# EAGLE design ANISMADriverBoard_v02 (EAGLE 9.5.2)
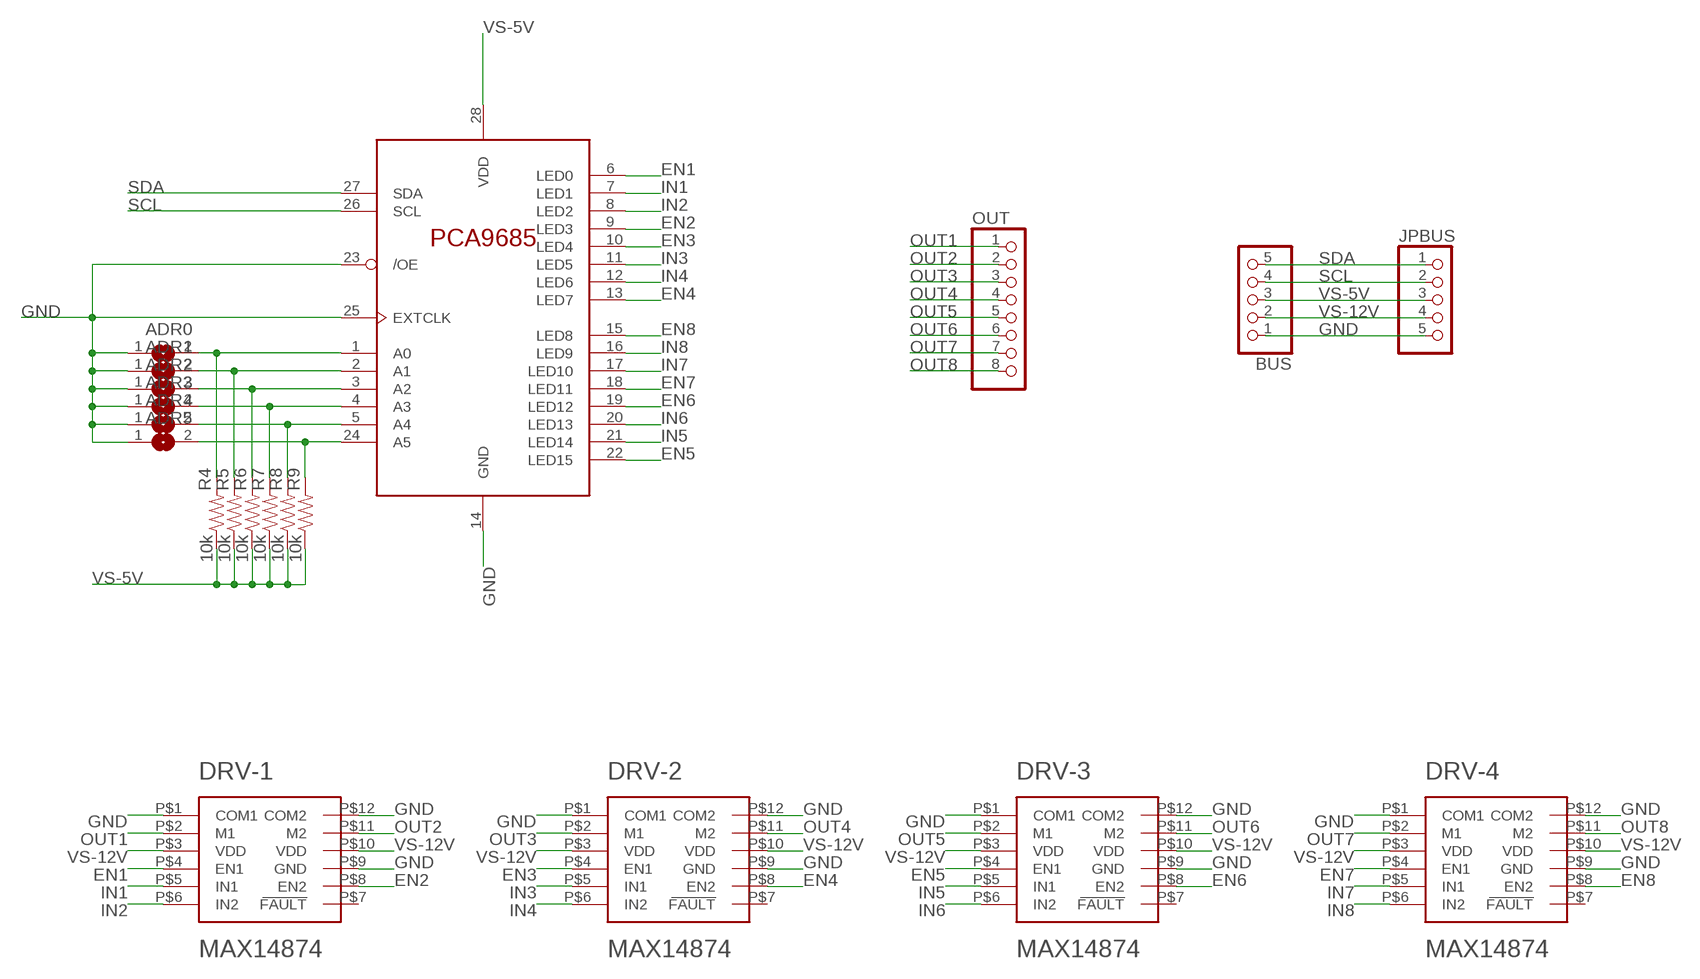
[diagram p0: schematic, sheet 1]

## Parts
ADR0  SJ  [SJ]
ADR1  SJ  [SJ]
ADR2  SJ  [SJ]
ADR3  SJ  [SJ]
ADR4  SJ  [SJ]
ADR5  SJ  [SJ]
BUS  PINHD-1X5/90  [1X05/90]
DRV-1  MAX14874  [TD1233]
DRV-2  MAX14874  [TD1233]
DRV-3  MAX14874  [TD1233]
DRV-4  MAX14874  [TD1233]
JPBUS  PINHD-1X5/90  [1X05/90]
OUT  PINHD-1X8/90  [1X08/90]
PCA9685  PCA9685PW  [TSSOP28]
R4  10k  10KOHM-0603-1/10W-1%  [0603]
R5  10k  10KOHM-0603-1/10W-1%  [0603]
R6  10k  10KOHM-0603-1/10W-1%  [0603]
R7  10k  10KOHM-0603-1/10W-1%  [0603]
R8  10k  10KOHM-0603-1/10W-1%  [0603]
R9  10k  10KOHM-0603-1/10W-1%  [0603]

## Nets
EN1: DRV-1.P$4(EN1) PCA9685.6(LED0)
EN2: DRV-1.P$8(EN2) PCA9685.9(LED3)
EN3: DRV-2.P$4(EN1) PCA9685.10(LED4)
EN4: DRV-2.P$8(EN2) PCA9685.13(LED7)
EN5: DRV-3.P$4(EN1) PCA9685.22(LED15)
EN6: DRV-3.P$8(EN2) PCA9685.19(LED12)
EN7: DRV-4.P$4(EN1) PCA9685.18(LED11)
EN8: DRV-4.P$8(EN2) PCA9685.15(LED8)
GND: ADR0.1 ADR1.1 ADR2.1 ADR3.1 ADR4.1 ADR5.1 BUS.1 DRV-1.P$1(COM1) DRV-1.P$9(GND) DRV-1.P$12(COM2) DRV-2.P$1(COM1) DRV-2.P$9(GND) DRV-2.P$12(COM2) DRV-3.P$1(COM1) DRV-3.P$9(GND) DRV-3.P$12(COM2) DRV-4.P$1(COM1) DRV-4.P$9(GND) DRV-4.P$12(COM2) JPBUS.5 PCA9685.14(GND) PCA9685.23(/OE) PCA9685.25(EXTCLK)
IN1: DRV-1.P$5(IN1) PCA9685.7(LED1)
IN2: DRV-1.P$6(IN2) PCA9685.8(LED2)
IN3: DRV-2.P$5(IN1) PCA9685.11(LED5)
IN4: DRV-2.P$6(IN2) PCA9685.12(LED6)
IN5: DRV-3.P$5(IN1) PCA9685.21(LED14)
IN6: DRV-3.P$6(IN2) PCA9685.20(LED13)
IN7: DRV-4.P$5(IN1) PCA9685.17(LED10)
IN8: DRV-4.P$6(IN2) PCA9685.16(LED9)
N$3: ADR0.2 PCA9685.1(A0) R4.2
N$4: ADR1.2 PCA9685.2(A1) R5.2
N$5: ADR2.2 PCA9685.3(A2) R6.2
N$6: ADR3.2 PCA9685.4(A3) R7.2
N$7: ADR4.2 PCA9685.5(A4) R8.2
N$8: ADR5.2 PCA9685.24(A5) R9.2
OUT1: DRV-1.P$2(M1) OUT.1
OUT2: DRV-1.P$11(M2) OUT.2
OUT3: DRV-2.P$2(M1) OUT.3
OUT4: DRV-2.P$11(M2) OUT.4
OUT5: DRV-3.P$2(M1) OUT.5
OUT6: DRV-3.P$11(M2) OUT.6
OUT7: DRV-4.P$2(M1) OUT.7
OUT8: DRV-4.P$11(M2) OUT.8
SCL: BUS.4 JPBUS.2 PCA9685.26(SCL)
SDA: BUS.5 JPBUS.1 PCA9685.27(SDA)
VS-5V: BUS.3 JPBUS.3 PCA9685.28(VDD) R4.1 R5.1 R6.1 R7.1 R8.1 R9.1
VS-12V: BUS.2 DRV-1.P$3(VDD) DRV-1.P$10(VDD) DRV-2.P$3(VDD) DRV-2.P$10(VDD) DRV-3.P$3(VDD) DRV-3.P$10(VDD) DRV-4.P$3(VDD) DRV-4.P$10(VDD) JPBUS.4
Unconnected: DRV-1.P$7(FAULT) DRV-2.P$7(FAULT) DRV-3.P$7(FAULT) DRV-4.P$7(FAULT)

## Library data of the parts
ADR0 ADR1-ADR5 = jumper:SJ: SMD solder JUMPER
BUS JPBUS = pinhead:PINHD-1X5: PIN HEADER
DRV-1-DRV-4 = Mo Custom Components:MAX14874
OUT = pinhead:PINHD-1X8: PIN HEADER
PCA9685 = i2c-led-controller:PCA9685
R4-R9 = SparkFun-Resistors:10KOHM: 10kΩ resistor A resistor is a passive two-terminal electrical component that implements electrical resistance as a circuit element. Resistors act to reduce current flow, and, at the same time, act to lower voltage levels within circuits. - Wikipedia; PROD_ID: RES-00824; SPICEPREFIX: R

## Board
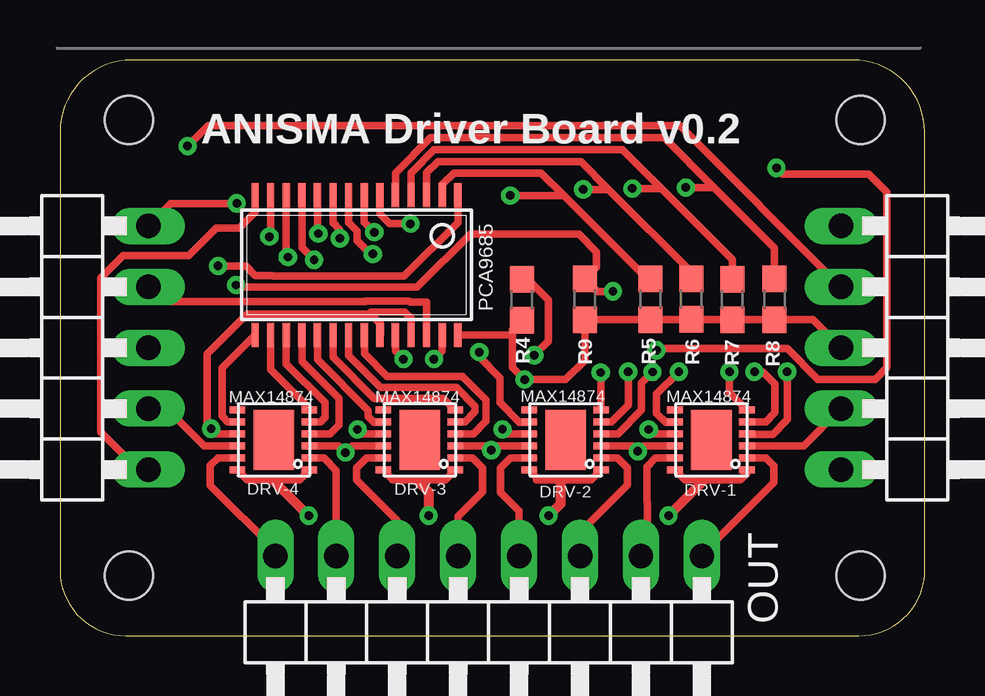
[diagram p1: board, top side]
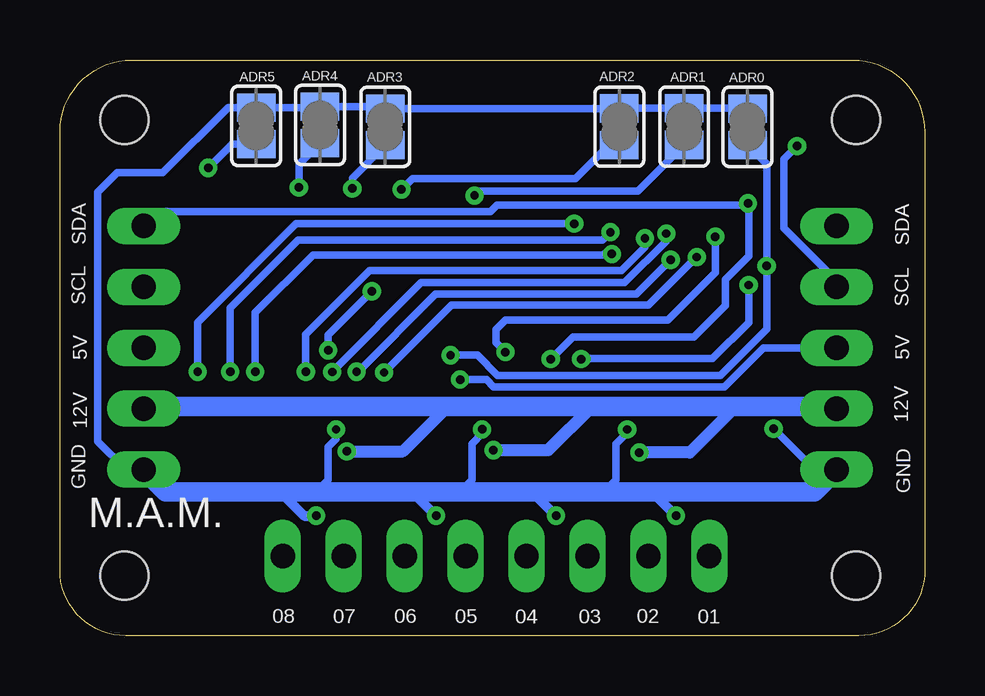
[diagram p2: board, bottom side, seen from below]

Size 36.05 x 24.01 mm. Coordinates in mm from the lower left corner, seen from the top.
Outline: 36.05,2.51 36.05,21.01 arc90 33.05,24.01 3,24.01 arc90 0,21.01 0,2.51 arc90 3,0.01 33.05,0.01 arc90 36.05,2.51
Copper layers (1*16): Top 0.035mm / dielectric 1.5mm / Bottom 0.035mm
Design rules "default *": minimum track width 6mil, minimum drill 0.35mm, track to track 6mil, track to pad 6mil, pad to pad 6mil, via to via 6mil, smd to smd 6mil, copper to edge 40mil, drill to drill 6mil, minimum pad ring 10mil, minimum via ring 8mil, stop-mask expansion 4mil, vias tented up to drill 0.5mm, thermal gap 10mil
Holes 2 mm at 2.87,21.51 2.87,2.51 33.37,2.51 33.37,21.51

### Footprints (pad centres in the part's own frame; a part is rotated, then mirrored left to right if it is on the bottom)
SJ = smd 1.168 x 1.6: 1 -0.762,0; 2 0.762,0
1X05/90 = drill 1.016 long: 1 -5.08,-3.81; 2 -2.54,-3.81; 3 0,-3.81; 4 2.54,-3.81; 5 5.08,-3.81
TD1233 = smd 0.65 x 0.3: P$1 -1.475,1.25; P$2 -1.475,0.75; P$3 -1.475,0.25; P$4 -1.475,-0.25; P$5 -1.475,-0.75; P$6 -1.475,-1.25; P$7 1.525,-1.25; P$8 1.525,-0.75; P$9 1.525,-0.25; P$10 1.525,0.25; P$11 1.525,0.75; P$12 1.525,1.25 | smd 1.7 x 2.5: P$13 0,0
1X08/90 = drill 1.016 long: 1 -8.89,-3.81; 2 -6.35,-3.81; 3 -3.81,-3.81; 4 -1.27,-3.81; 5 1.27,-3.81; 6 3.81,-3.81; 7 6.35,-3.81; 8 8.89,-3.81
TSSOP28 = smd 0.305 x 0.991: 1 -4.225,-2.918; 2 -3.575,-2.918; 3 -2.925,-2.918; 4 -2.275,-2.918; 5 -1.625,-2.918; 6 -0.975,-2.918; 7 -0.325,-2.918; 8 0.325,-2.918; 9 0.975,-2.918; 10 1.625,-2.918; 11 2.275,-2.918; 12 2.925,-2.918; 13 3.575,-2.918; 14 4.225,-2.918; 15 4.225,2.918; 16 3.575,2.918; 17 2.925,2.918; 18 2.275,2.918; 19 1.625,2.918; 20 0.975,2.918; 21 0.325,2.918; 22 -0.325,2.918; 23 -0.975,2.918; 24 -1.625,2.918; 25 -2.275,2.918; 26 -2.925,2.918; 27 -3.575,2.918; 28 -4.225,2.918
0603 = smd 1.1 x 1: 1 -0.85,0; 2 0.85,0

### Placement (x,y rotation side)
ADR0  7.39,21.22 270 bottom
ADR1  10.03,21.23 270 bottom
ADR2  12.73,21.23 270 bottom
ADR3  22.49,21.22 270 bottom
ADR4  25.21,21.3 270 bottom
ADR5  27.87,21.26 270 bottom
BUS  -0.13,12.01 90 top
DRV-1  27.16,8.17 180 top
DRV-2  21.08,8.17 180 top
DRV-3  15,8.17 180 top
DRV-4  8.92,8.17 180 top
JPBUS  36.37,12.01 270 top
OUT  17.87,-0.49 180 top
PCA9685  12.36,15.46 180 top
R4  19.25,14.01 90 top
R5  24.62,14.03 90 top
R6  26.32,14.04 90 top
R7  28.03,14.02 90 top
R8  29.79,14.03 90 top
R9  21.88,14.03 90 top

### Tracks (layer width: path | path; a pad name or v marks a point on that pad's centre or on a via)
EN1  (via drill 0.35)
  Top 0.305: DRV-1.P$4 28.65,8.41 29.71,8.41 30.32,9.02 30.32,10.65 30.31,10.66 v30.31,11.01 | PCA9685.6 13.34,17.59 13.74,17.18 v14.61,17.18
  Bottom 0.305: v14.61,17.18 26.2,17.18 30.31,13.07 v30.31,11.01
EN2  (via drill 0.35)
  Top 0.305: DRV-1.P$8 25.6,8.89 25.26,8.89 24.87,9.28 24.87,10.08 v25.8,11.01 | PCA9685.9 11.39,17.2 11.4,17.21 11.66,16.94 v11.66,16.57
  Bottom 0.305: v11.66,16.57 11.66,16.22 12.65,15.23 23.15,15.23 25.81,12.57 25.81,10.96 25.8,10.97 v25.8,11.01
EN3  (via drill 0.35)
  Top 0.305: DRV-2.P$4 23.25,8.42 24.24,9.41 24.24,10.54 v24.7,11 | PCA9685.10 10.73,16.81 v10.77,16.77
  Bottom 0.305: v10.77,16.77 10.77,16.46 12.51,14.72 21,14.72 24.61,11.11 24.61,11.09 v24.7,11
EN4  (via drill 0.35)
  Top 0.305: DRV-2.P$8 19.54,8.91 19.16,8.91 18.35,9.72 18.35,10.76 17.48,11.63 v17.48,11.83 | PCA9685.13 8.79,16.69 v8.73,16.64
  Bottom 0.305: v8.73,16.64 8.73,15.15 10.71,13.17 17.48,13.17 17.87,12.78 17.87,12.22 v17.48,11.83
EN5
  Top 0.305: DRV-3.P$4 17.24,8.42 17.77,8.95 17.77,9.83 16.79,10.82 13.65,10.82 12.69,11.77 PCA9685.22
EN6
  Top 0.305: DRV-3.P$8 13.46,8.91 13.08,8.91 12.84,9.15 12.84,9.41 10.73,11.52 PCA9685.19
EN7
  Top 0.305: DRV-4.P$4 11.25,8.42 11.63,8.8 11.63,9.89 10.09,11.44 PCA9685.18
EN8
  Top 0.305: DRV-4.P$8 6.98,8.93 6.75,9.16 6.75,11.16 PCA9685.15
GND  (via drill 0.35)
  Top 0.305: DRV-4.P$1 9.98,6.51 8.87,6.51 7.81,6.51 DRV-4.P$12 | DRV-3.P$12 13.87,6.53 13.87,6.51 14.87,6.51 16.07,6.51 DRV-3.P$1 | DRV-2.P$12 19.87,6.61 19.87,6.51 20.87,6.51 22.14,6.51 DRV-2.P$1 | DRV-1.P$12 26.05,6.51 26.87,6.51 28.37,6.51 28.64,6.78 DRV-1.P$1 | DRV-3.P$9 12.4,8.42 v12.4,8.6 | DRV-4.P$9 6.41,8.42 6.3,8.53 v6.3,8.63 6.13,8.8 6.13,11.75 7.8,13.42 12.87,13.42 | DRV-2.P$9 19.55,8.41 18.67,8.41 18.47,8.61 v18.45,8.61 | DRV-1.P$9 24.72,8.42 v24.54,8.6 | BUS.1 3.27,6.93 1.7,8.5 1.7,14.92 2.64,15.86 5.37,15.86 6.52,17.01 7.48,17.01 8.14,17.67 PCA9685.14 | 12.87,13.42 12.96,13.42 13.37,13.01 13.37,12.58 PCA9685.23 | PCA9685.25 14.64,13.25 14.37,13.51 12.96,13.51 12.87,13.42
  Top 0.406: 8.87,6.51 v10.37,5.01 | 14.87,6.51 15.37,6.01 v15.37,5.01 | 20.87,6.51 20.87,5.51 v20.37,5.01 | v25.37,5.01 26.87,6.51
  Bottom 0.305: 16.37,6.01 16.87,6.01 | 21.37,6.01 21.87,6.01 | v12.4,8.6 12.4,8.48 12.87,8.01 12.87,6.51 13.37,6.01 | v6.3,8.63 4.6,6.93 BUS.1 | v18.45,8.61 18.45,8.43 18.87,8.01 18.87,6.51 19.37,6.01 | v24.54,8.6 24.54,8.21 24.87,7.88 24.87,6.51 25.37,6.01 | JPBUS.5 33.29,6.93 34.47,8.11 34.47,18.5 33.66,19.31 31.76,19.31 29.05,22.02 ADR5.1 25.25,22.02 ADR4.1 22.57,22.06 ADR3.1 ADR2.1 ADR1.1 7.4,21.99 ADR0.1
  Bottom 0.406: v10.37,5.01 11.37,6.01 | v15.37,5.01 16.37,6.01 | v20.37,5.01 21.37,6.01 | 26.87,6.01 25.87,5.01 v25.37,5.01
  Bottom 0.813: BUS.1 4.6,6.01 11.37,6.01 13.37,6.01 16.87,6.01 19.37,6.01 21.87,6.01 25.37,6.01 26.87,6.01 31.64,6.01 JPBUS.5
IN1  (via drill 0.35)
  Top 0.305: DRV-1.P$5 29.42,8.92 29.81,9.31 29.81,10.51 29.31,11.01 v28.95,11.01 | PCA9685.7 12.68,17.25 v13.1,16.83
  Bottom 0.305: v13.1,16.83 13.44,16.49 26.13,16.49 28.95,13.67 v28.95,11.01
IN2  (via drill 0.35)
  Top 0.305: PCA9685.8 12.04,17.23 12.38,16.89 12.38,16.49 12.94,15.92 v13.04,15.92 | v27.91,11.01 27.91,10.15 DRV-1.P$6
  Bottom 0.305: v13.04,15.92 13.36,15.92 13.41,15.87 20.87,15.87 25.51,15.87 27.91,13.47 v27.91,11.01
IN3  (via drill 0.35)
  Top 0.305: DRV-2.P$5 22.99,8.92 23.7,9.63 23.7,11 v23.69,11.01 | PCA9685.11 10.09,16.18 v10.59,15.68
  Bottom 0.305: v10.59,15.68 12.03,14.24 20.4,14.24 23.63,11.01 v23.69,11.01
IN4  (via drill 0.35)
  Top 0.305: PCA9685.12 9.43,15.86 v9.5,15.79 | v22.54,10.98 22.55,10.97 DRV-2.P$6
  Bottom 0.305: v9.5,15.79 v9.51,15.79 11.52,13.78 19.74,13.78 v22.54,10.98
IN5
  Top 0.305: PCA9685.21 12.04,11.7 13.37,10.36 16.52,10.36 17.31,9.57 17.31,9.35 16.88,8.92 DRV-3.P$5
IN6
  Top 0.305: PCA9685.20 11.39,11.62 13.1,9.9 16,9.9 DRV-3.P$6
IN7
  Top 0.305: DRV-4.P$5 10.87,8.92 11.05,9.1 11.05,9.72 9.43,11.34 PCA9685.17
IN8
  Top 0.305: PCA9685.16 8.79,11.11 10.39,9.5 DRV-4.P$6
N$3  (via drill 0.35)
  Top 0.305: PCA9685.1 16.59,17.23 14.35,14.99 8.89,14.99 8.85,15.03 8.14,15.03 7.75,15.42 v6.59,15.42 | v19.77,11.7 20.37,12.3 20.37,14.01 19.52,14.86 R4.2
  Bottom 0.305: v19.77,11.7 18.65,11.7 17.8,10.85 8.53,10.85 6.59,12.79 v6.59,15.42 6.59,19.51 6.59,19.66 ADR0.2
N$4  (via drill 0.35)
  Top 0.305: R5.2 24.48,14.88 21,18.36 | 21,18.36 20.06,19.3 16.43,19.3 15.94,18.81 PCA9685.2 | v18.77,18.36 21,18.36
  Bottom 0.305: ADR1.2 11.96,18.54 18.59,18.54 v18.77,18.36
N$5  (via drill 0.35)
  Top 0.305: R6.2 26.32,15.16 22.87,18.61 | 22.87,18.61 21.71,19.77 15.75,19.77 15.29,19.31 PCA9685.3 | v21.81,18.61 22.87,18.61
  Bottom 0.305: ADR2.2 13.17,20.47 14.56,19.07 21.36,19.07 v21.81,18.61
N$6  (via drill 0.35)
  Top 0.305: R7.2 28.03,15.69 25.07,18.65 | 25.07,18.65 23.45,20.27 15.6,20.27 14.64,19.3 PCA9685.4 | v23.86,18.65 25.07,18.65
  Bottom 0.305: v23.86,18.65 23.86,19.09 ADR3.2
N$7  (via drill 0.35)
  Top 0.305: R8.2 29.79,16.17 27.27,18.69 | 27.27,18.69 25.2,20.77 15.45,20.77 13.98,19.3 PCA9685.5 | v26.09,18.69 27.27,18.69
  Bottom 0.305: ADR4.2 26.09,19.66 v26.09,18.69
N$8  (via drill 0.35)
  Top 0.305: PCA9685.24 13.98,11.87 v14.32,11.54 | v7.34,14.62 7.43,14.53 14.89,14.53 17.11,16.75 21.63,16.75 22.37,16.01 22.37,15.37 R9.2 22.4,14.36 v23.05,14.36 | v24.87,11.91 24.93,11.97 30.32,11.97 31.6,10.69 33.98,10.69 34.47,11.18 34.47,18.5 33.71,19.26 30.12,19.26 v29.87,19.51
  Bottom 0.305: v14.32,11.54 14.3,11.56 8.84,11.56 7.34,13.06 v7.34,14.62 | v23.05,14.36 24.87,12.55 v24.87,11.91 | v29.87,19.51 28.88,20.5 ADR5.2
OUT1
  Top 0.305: DRV-1.P$2 29.43,7.42 29.76,7.09 29.76,6.39 26.76,3.39 OUT.1
OUT2
  Top 0.305: DRV-1.P$11 24.83,7.42 24.46,7.05 24.46,5.59 24.48,5.57 24.48,3.58 OUT.2
OUT3
  Top 0.305: DRV-2.P$2 23.24,7.42 23.66,7 23.66,6.29 21.68,4.31 OUT.3
OUT4
  Top 0.305: DRV-2.P$11 18.78,7.42 18.37,7.01 18.37,5.98 19.14,5.21 OUT.4
OUT5
  Top 0.305: DRV-3.P$2 17.19,7.42 17.62,6.99 17.62,6 16.6,4.98 OUT.5
OUT6
  Top 0.305: DRV-3.P$11 12.78,7.42 12.37,7.01 12.37,6.51 14.06,4.82 OUT.6
OUT7
  Top 0.305: DRV-4.P$2 11,7.42 11.52,6.9 OUT.7
OUT8
  Top 0.305: DRV-4.P$11 6.59,7.42 6.27,7.1 6.27,6.28 8.98,3.57 OUT.8
SCL  (via drill 0.35)
  Top 0.305: PCA9685.26 15.29,13.93 14.6,13.93 14.56,13.97 12.77,13.97 12.74,13.94 4.29,13.94 BUS.4 | v5.32,20.42 6.17,21.27 25.84,21.27 JPBUS.2
  Bottom 0.305: v5.32,20.42 5.87,19.87 5.87,17.01 3.68,14.82 BUS.4
SDA  (via drill 0.35)
  Top 0.305: PCA9685.27 15.94,11.88 v15.59,11.54 | v7.37,18.03 4.62,18.03 BUS.5
  Bottom 0.305: v15.59,11.54 14.66,12.46 9.63,12.46 8.32,13.77 8.32,14.85 7.34,15.83 7.34,18.03 v7.37,18.03 7.45,17.95 17.83,17.95 18.11,17.68 31.97,17.68 JPBUS.1
VS-5V  (via drill 0.35)
  Top 0.305: 18.87,12.54 PCA9685.28 | R4.1 18.87,12.78 18.87,12.54 | 18.87,12.54 18.87,11.18 v19.37,10.68 21.08,10.68 21.88,11.48 R9.1 R5.1 R6.1 28.01,13.19 R7.1 R8.1 31.39,13.18 JPBUS.3
  Bottom 0.305: BUS.3 6.72,12.01 8.35,10.39 17.98,10.39 18.28,10.68 v19.37,10.68
VS-12V  (via drill 0.35)
  Top 0.305: DRV-4.P$3 11.62,7.92 v11.9,7.64 12.18,7.92 DRV-3.P$10 | DRV-3.P$3 17.8,7.92 v17.98,7.74 18.16,7.92 DRV-2.P$10 | DRV-2.P$3 23.86,7.92 v24.09,7.69 24.32,7.92 DRV-1.P$10 | DRV-4.P$10 6,7.92 4.45,9.47 BUS.2 | JPBUS.4 31.01,7.92 DRV-1.P$3
  Bottom 0.508: 7.87,9.57 9.8,7.64 v11.9,7.64 | 13.87,9.57 15.7,7.74 v17.98,7.74 | 19.87,9.57 21.75,7.69 v24.09,7.69
  Bottom 0.813: BUS.2 3.78,9.57 7.87,9.57 13.87,9.57 19.87,9.57 32.46,9.57 JPBUS.4

### Text on the board
tNames: ANISMA Driver Board v0.2
bNames: SDA | SDA | SCL | SCL | 5V | 5V | 12V | 12V | GND | GND | M.A.M. | 01 | 02 | 03 | 04 | 05 | 06 | 07 | 08